# EAGLE design Falhaber sensors (EAGLE 9.6.2)
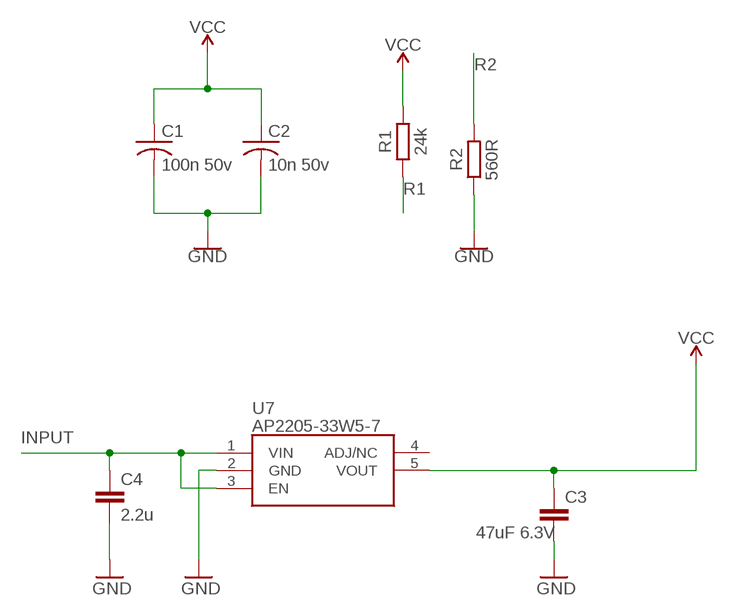
[diagram p0: schematic, sheet 1]

## Parts
C1  100n 50v  C-USC0805  [C0805]
C2  10n 50v  C-USC0805  [C0805]
C3  47uF 6.3V  4.7UF-6.3V-10%(0603)0603  [0603-CAP]
C4  2.2u  4.7UF-6.3V-10%(0603)0603  [0603-CAP]
R1  24k  R_CHIP-0805(2012-METRIC)  [RESC2012X65]
R2  560R  R_CHIP-0805(2012-METRIC)  [RESC2012X65]
U7  AP2205-33W5-7  AP2205-W5-7  [SOT95P282X145-5N]

## Nets
GND: C1.2 C2.2 C3.2 C4.2 R2.1 U7.2(GND)
INPUT: C4.1 U7.1(VIN) U7.3(EN)
R1: R1.1
R2: R2.2
VCC: C1.1 C2.1 C3.1 R1.2 U7.5(VOUT)
Unconnected: U7.4(ADJ/NC)

## Library data of the parts
C1 C2 = adafruit:C-US: CAPACITOR, American symbol
C3 C4 = SparkFun-Capacitors:4.7UF-6.3V-10%(0603): CAP-08280; PROD_ID: CAP-08280; VALUE: 4.7uF
R1 R2 = Resistor:R: Resistor Fixed - Generic; CATEGORY: Resistor; SUB-CATEGORY: Fixed
U7 = AP2205-W5-7:AP2205-W5-7: LDO Voltage Regulators LDO CMOS LowCurr Source: Datasheet <https://www.diodes.com/assets/Datasheets/AP2206.pdf>; DESCRIPTION: LDO Voltage Regulators LDO CMOS LowCurr; HEIGHT: 1.45mm; MANUFACTURER_NAME: Diodes Inc.; MANUFACTURER_PART_NUMBER: AP2205-W5-7; MOUSER_PART_NUMBER: 621-AP2205-W5-7; MOUSER_PRICE-STOCK: https://www.mouser.com/Search/Refine.aspx?Keyword=621-AP2205-W5-7

## Board
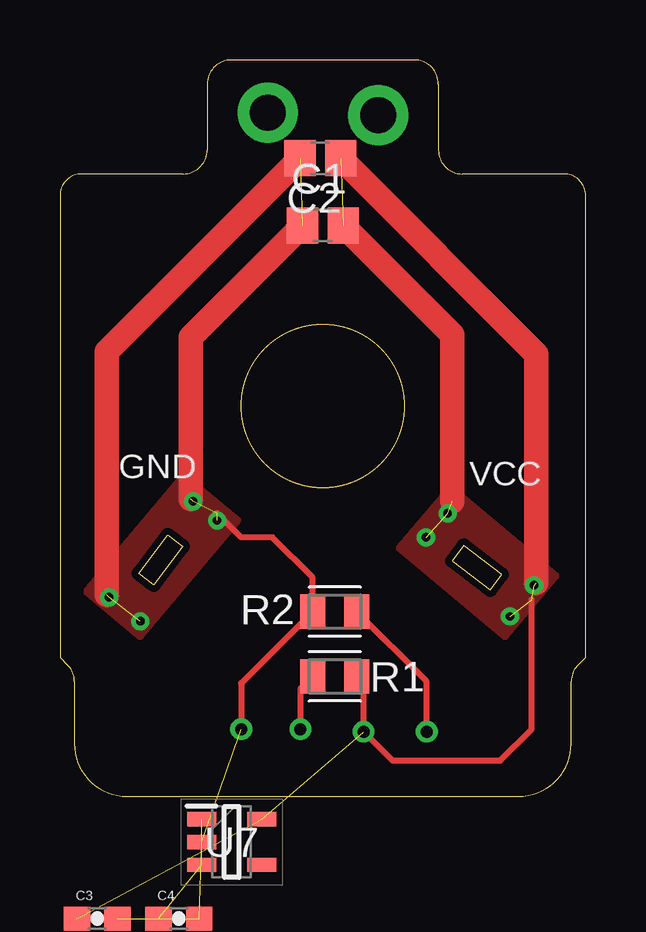
[diagram p1: board, top side]
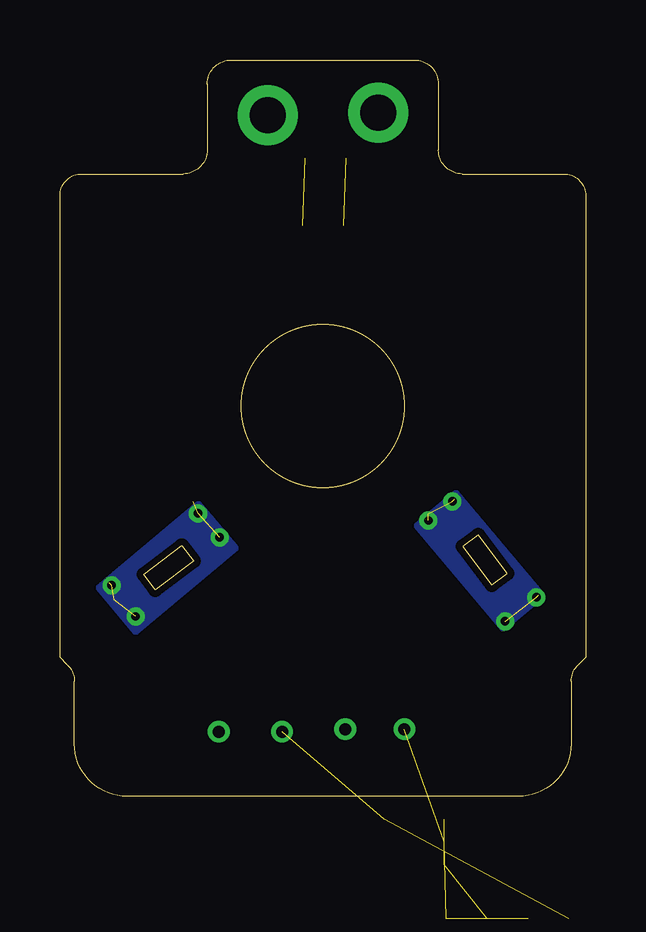
[diagram p2: board, bottom side, seen from below]

Size 21.9 x 30.7 mm. Coordinates in mm from the lower left corner, seen from the top.
Outline: 15.77,26.95 arc90 16.77,25.95 21,25.95 arc-90 21.9,25.05 21.9,5.8 21.59,5.49 arc45 21.3,4.78 21.3,2.2 arc-90 19.1,0 2.8,0 arc-90 0.6,2.2 0.6,4.78 arc45 0.31,5.49 0,5.8 0,25.05 arc-90 0.9,25.95 5.13,25.95 arc90 6.13,26.95 6.13,29.7 arc-90 7.13,30.7 14.77,30.7 arc-90 15.77,29.7 15.77,26.95
Outline: 17.93,8.6 18.41,9.24 16.82,10.45 16.34,9.81 17.93,8.6
Outline: 3.27,9.3 4.48,10.9 5.12,10.41 3.91,8.82 3.27,9.3
Outline: circle at 10.95,16.28 radius 3.4
Copper layers (1*16): Top 0.035mm / dielectric 1.5mm / Bottom 0.035mm
Design rules "default *": minimum track width 6mil, minimum drill 0.35mm, track to track 6mil, track to pad 6mil, pad to pad 6mil, via to via 6mil, smd to smd 0mil, copper to edge 12mil, drill to drill 6mil, minimum pad ring 10mil, minimum via ring 8mil, stop-mask expansion 4mil, vias tented up to drill 0mil, thermal gap 10mil

### Footprints (pad centres in the part's own frame; a part is rotated, then mirrored left to right if it is on the bottom)
C0805 = smd 1.3 x 1.5: 1 -0.85,0; 2 0.85,0
0603-CAP = smd 1.1 x 1: 1 -0.85,0; 2 0.85,0
RESC2012X65 = smd 1.031 x 1.42: 1 -0.919,0; 2 0.919,0
SOT95P282X145-5N = smd 1.2 x 0.6: 1 -1.25,0.95; 2 -1.25,0; 3 -1.25,-0.95; 4 1.25,-0.95; 5 1.25,0.95

### Placement (x,y rotation side)
C1  10.95,23.8 180 top
C2  10.85,26.6 180 top
C3  1.55,-5.1 0 top  (outside the outline)
C4  4.95,-5.1 0 top  (outside the outline)
R1  11.45,5 0 top
R2  11.45,7.7 0 top
U7  7.15,-1.9 0 top

### Tracks (layer width: path | path; a pad name or v marks a point on that pad's centre or on a via)
GND  (via drill 0.35, 0.5)  (9 unrouted)
  Top 0.254: v7.55,2.8 7.55,4.72 R2.1 10.53,9.12 8.85,10.8 7.55,10.8 6.55,11.8
  Top 1.016: C1.2 5.45,19.15 5.45,12.4 | C2.2 1.95,18.55 1.95,8.4
  other vias: 2.05,8.3 3.35,7.3 6.55,11.5 5.55,12.3
  pour Bottom: 5.41,12.7 1.76,8.36 3.44,6.95 7.08,11.29
  pour Top: 5.15,13.45 1.03,8.55 3.35,6.61 7.46,11.51
GND1  (via drill 1.5 pad 2.5)
  other vias: 8.65,28.5
GND2  (via drill 1.5 pad 2.5)
  other vias: 13.25,28.4
INPUT  (2 unrouted)
R1  (via drill 0.5)
  Top 0.254: R1.1 10.02,4.49 v10.02,2.8
R2  (via drill 0.5)
  Top 0.254: v15.28,2.7 15.25,2.73 15.25,4.82 R2.2
VCC  (via drill 0.35, 0.5)  (8 unrouted)
  Top 0.254: R1.2 12.65,4.72 v12.65,2.7 13.85,1.5 18.35,1.5 19.65,2.8 19.65,8.2
  Top 1.016: C1.1 16.35,19.25 16.35,12.3 | C2.1 19.85,18.45 19.85,8.9
  other vias: 15.25,10.8 16.15,11.8 18.75,7.5 19.75,8.8
  pour Top: 20.72,9.19 16.25,12.94 14.08,10.35 18.55,6.6
  pour Bottom: 20.33,8.71 16.13,12.23 14.54,10.33 18.74,6.81

### Text on the board
tPlace: GND | VCC